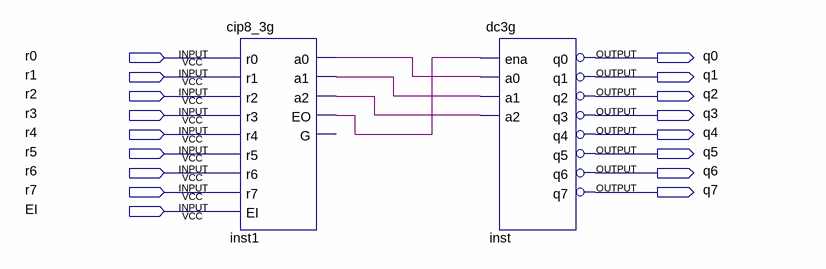
[diagram p0: schematic sheet]
// Quartus schematic ptr8_8g.bdf as structural Verilog: 2 symbols, 17 pins
module ptr8_8g (
  input  r0,
  input  r1,
  input  r2,
  input  r3,
  input  r4,
  input  r5,
  input  r6,
  input  r7,
  input  EI,
  output q0,
  output q1,
  output q2,
  output q3,
  output q4,
  output q5,
  output q6,
  output q7
);

  wire inst1_a0, inst1_a1, inst1_a2, inst1_eo, inst_q0, inst_q1, inst_q2, inst_q3, inst_q4, inst_q5, inst_q6,
       inst_q7;

  cip8_3g inst1 (
    .r0(r0), .r1(r1), .r2(r2), .r3(r3), .r4(r4), .r5(r5), .r6(r6), .r7(r7), .EI(EI), .a0(inst1_a0),
    .a1(inst1_a1), .a2(inst1_a2), .EO(inst1_eo));  // open: G
  dc3g inst (
    .ena(inst1_eo), .a0(inst1_a0), .a1(inst1_a1), .a2(inst1_a2), .q0(inst_q0), .q1(inst_q1), .q2(inst_q2),
    .q3(inst_q3), .q4(inst_q4), .q5(inst_q5), .q6(inst_q6), .q7(inst_q7));
  not inst_q0_inverted (q0, inst_q0);
  not inst_q1_inverted (q1, inst_q1);
  not inst_q2_inverted (q2, inst_q2);
  not inst_q3_inverted (q3, inst_q3);
  not inst_q4_inverted (q4, inst_q4);
  not inst_q5_inverted (q5, inst_q5);
  not inst_q6_inverted (q6, inst_q6);
  not inst_q7_inverted (q7, inst_q7);
endmodule
